# Altium schematic sheet TP1_NodoWiFi_Cpu1_Rev0.SchDoc: TP1 NodoWifi Cpu1 Rev0
size A4; Author: Alejandro Darío Sobral; SheetNumber: 5; SheetTotal: 5
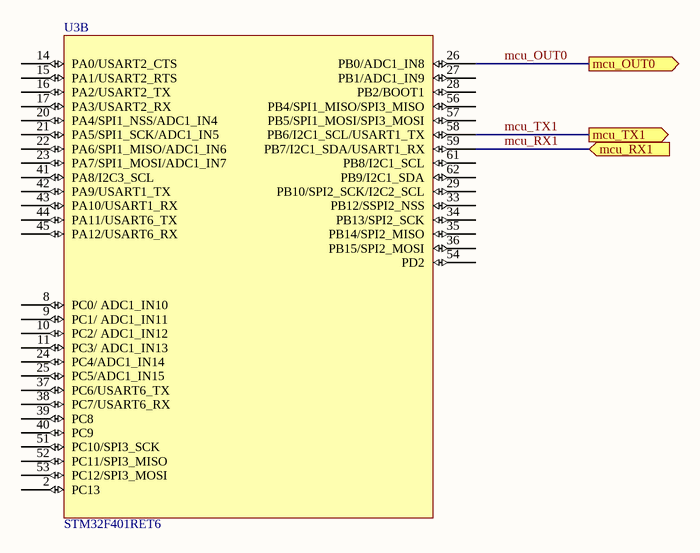
[diagram p0: TP1_NodoWiFi_Cpu1_Rev0.SchDoc]

## Parts
U3  STM32F401RET6  [LQFP_64]  (part B of 2)

## Ports
mcu_OUT0 (out, see TP1_NodoWiFi_blk_Rev0[3B], TP1_NodoWiFi_Per_Rev0[1C]), mcu_RX1 (in, see TP1_NodoWiFi_blk_Rev0[3B], TP1_NodoWiFi_Per_Rev0[3A]), mcu_TX1 (out, see TP1_NodoWiFi_blk_Rev0[3B], TP1_NodoWiFi_Per_Rev0[3A])

## Nets
mcu_OUT0: U3.26(PB0/ADC1_IN8) ; port mcu_OUT0
mcu_RX1: U3.59(PB7/I2C1_SDA/USART1_RX) ; port mcu_RX1
mcu_TX1: U3.58(PB6/I2C1_SCL/USART1_TX) ; port mcu_TX1

Not connected (* = marked no-connect by the designer): U3 2(PC13) 8(PC0/_ADC1_IN10) 9(PC1/_ADC1_IN11) 10(PC2/_ADC1_IN12) 11(PC3/_ADC1_IN13) 14(PA0/USART2_CTS) 15(PA1/USART2_RTS) 16(PA2/USART2_TX) 17(PA3/USART2_RX) 20(PA4/SPI1_NSS/ADC1_IN4) 21(PA5/SPI1_SCK/ADC1_IN5) 22(PA6/SPI1_MISO/ADC1_IN6) 23(PA7/SPI1_MOSI/ADC1_IN7) 24(PC4/ADC1_IN14) 25(PC5/ADC1_IN15) 27(PB1/ADC1_IN9) 28(PB2/BOOT1) 29(PB10/SPI2_SCK/I2C2_SCL) 33(PB12/SSPI2_NSS) 34(PB13/SPI2_SCK) 35(PB14/SPI2_MISO) 36(PB15/SPI2_MOSI) 37(PC6/USART6_TX) 38(PC7/USART6_RX) 39(PC8) 40(PC9) 41(PA8/I2C3_SCL) 42(PA9/USART1_TX) 43(PA10/USART1_RX) 44(PA11/USART6_TX) 45(PA12/USART6_RX) 51(PC10/SPI3_SCK) 52(PC11/SPI3_MISO) 53(PC12/SPI3_MOSI) 54(PD2) 56(PB4/SPI1_MISO/SPI3_MISO) 57(PB5/SPI1_MOSI/SPI3_MOSI) 61(PB8/I2C1_SCL) 62(PB9/I2C1_SDA)

## Notes on the sheet
- Title:
- Size:
- Author:
- A4
- Sheet
- of
- Revision:
- File:
- Date:

## Library data of the parts
U3 = STM32F401RE